# EAGLE schematic tablet (EAGLE 8.4.3)

## Sheet 1 of 2
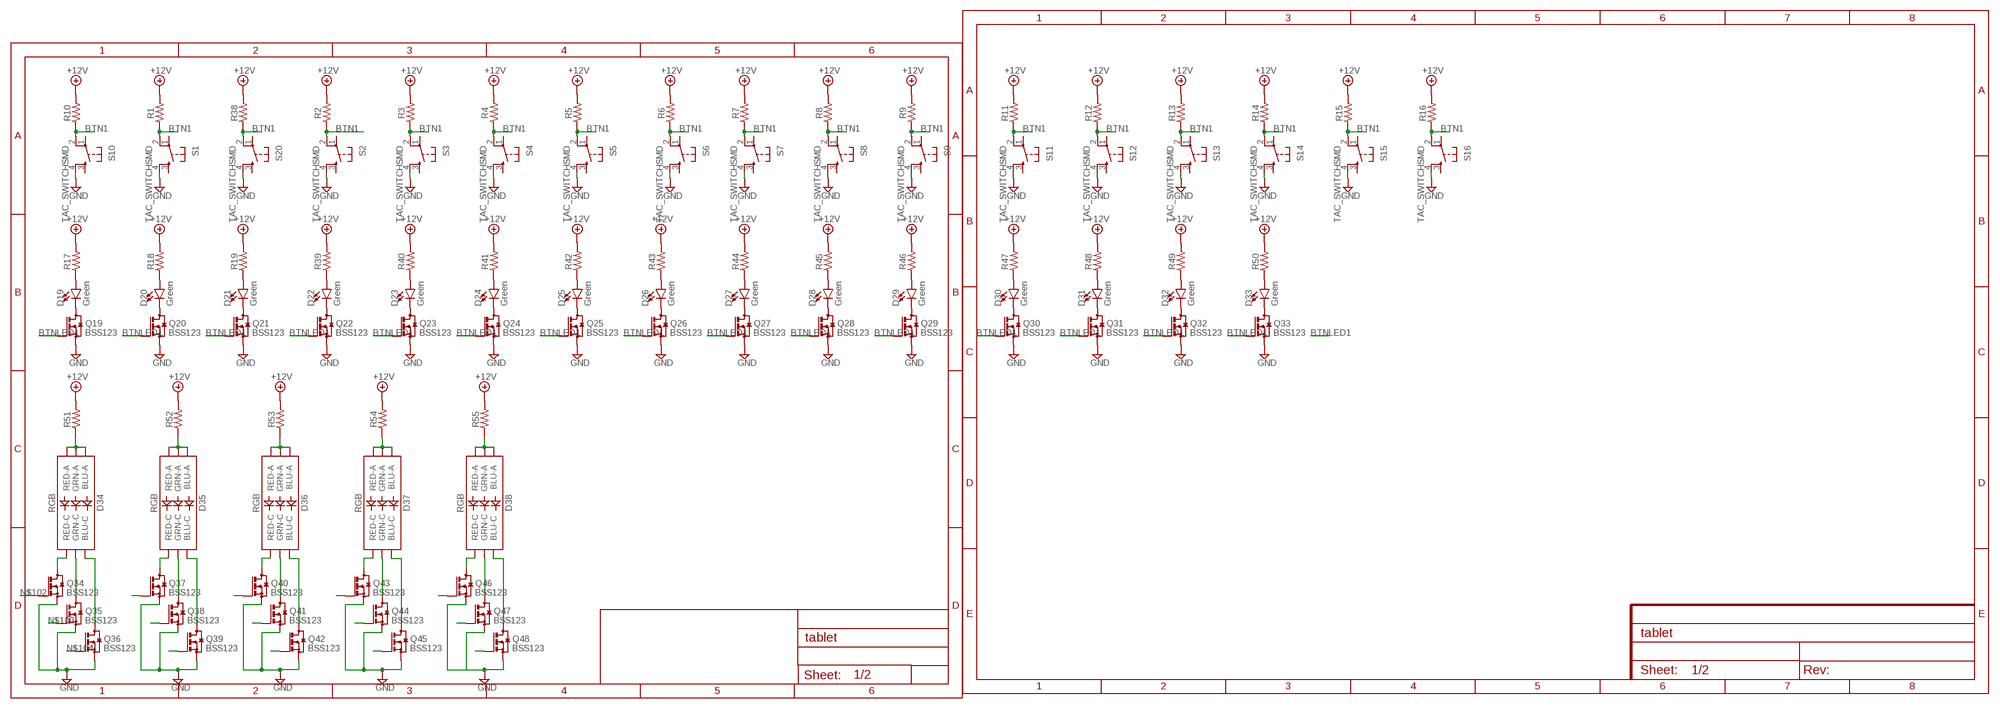
[diagram p0: schematic, sheet 1]

### Parts
D19  Green  LED-GREEN1206-BOTTOM  [LED-1206-BOTTOM]
D20  Green  LED-GREEN1206-BOTTOM  [LED-1206-BOTTOM]
D21  Green  LED-GREEN1206-BOTTOM  [LED-1206-BOTTOM]
D22  Green  LED-GREEN1206-BOTTOM  [LED-1206-BOTTOM]
D23  Green  LED-GREEN1206-BOTTOM  [LED-1206-BOTTOM]
D24  Green  LED-GREEN1206-BOTTOM  [LED-1206-BOTTOM]
D25  Green  LED-GREEN1206-BOTTOM  [LED-1206-BOTTOM]
D26  Green  LED-GREEN1206-BOTTOM  [LED-1206-BOTTOM]
D27  Green  LED-GREEN1206-BOTTOM  [LED-1206-BOTTOM]
D28  Green  LED-GREEN1206-BOTTOM  [LED-1206-BOTTOM]
D29  Green  LED-GREEN1206-BOTTOM  [LED-1206-BOTTOM]
D30  Green  LED-GREEN1206-BOTTOM  [LED-1206-BOTTOM]
D31  Green  LED-GREEN1206-BOTTOM  [LED-1206-BOTTOM]
D32  Green  LED-GREEN1206-BOTTOM  [LED-1206-BOTTOM]
D33  Green  LED-GREEN1206-BOTTOM  [LED-1206-BOTTOM]
D34  RGB  LED-RGBPLCC-6  [PLCC-6-LED]
D35  RGB  LED-RGBPLCC-6  [PLCC-6-LED]
D36  RGB  LED-RGBPLCC-6  [PLCC-6-LED]
D37  RGB  LED-RGBPLCC-6  [PLCC-6-LED]
D38  RGB  LED-RGBPLCC-6  [PLCC-6-LED]
Q19  BSS123  [SOT23]
Q20  BSS123  [SOT23]
Q21  BSS123  [SOT23]
Q22  BSS123  [SOT23]
Q23  BSS123  [SOT23]
Q24  BSS123  [SOT23]
Q25  BSS123  [SOT23]
Q26  BSS123  [SOT23]
Q27  BSS123  [SOT23]
Q28  BSS123  [SOT23]
Q29  BSS123  [SOT23]
Q30  BSS123  [SOT23]
Q31  BSS123  [SOT23]
Q32  BSS123  [SOT23]
Q33  BSS123  [SOT23]
Q34  BSS123  [SOT23]
Q35  BSS123  [SOT23]
Q36  BSS123  [SOT23]
Q37  BSS123  [SOT23]
Q38  BSS123  [SOT23]
Q39  BSS123  [SOT23]
Q40  BSS123  [SOT23]
Q41  BSS123  [SOT23]
Q42  BSS123  [SOT23]
Q43  BSS123  [SOT23]
Q44  BSS123  [SOT23]
Q45  BSS123  [SOT23]
Q46  BSS123  [SOT23]
Q47  BSS123  [SOT23]
Q48  BSS123  [SOT23]
R1  RESISTOR1206  [1206]
R2  RESISTOR1206  [1206]
R3  RESISTOR1206  [1206]
R4  RESISTOR1206  [1206]
R5  RESISTOR1206  [1206]
R6  RESISTOR1206  [1206]
R7  RESISTOR1206  [1206]
R8  RESISTOR1206  [1206]
R9  RESISTOR1206  [1206]
R10  RESISTOR1206  [1206]
R11  RESISTOR1206  [1206]
R12  RESISTOR1206  [1206]
R13  RESISTOR1206  [1206]
R14  RESISTOR1206  [1206]
R15  RESISTOR1206  [1206]
R16  RESISTOR1206  [1206]
R17  RESISTOR1206  [1206]
R18  RESISTOR1206  [1206]
R19  RESISTOR1206  [1206]
R38  RESISTOR1206  [1206]
R39  RESISTOR1206  [1206]
R40  RESISTOR1206  [1206]
R41  RESISTOR1206  [1206]
R42  RESISTOR1206  [1206]
R43  RESISTOR1206  [1206]
R44  RESISTOR1206  [1206]
R45  RESISTOR1206  [1206]
R46  RESISTOR1206  [1206]
R47  RESISTOR1206  [1206]
R48  RESISTOR1206  [1206]
R49  RESISTOR1206  [1206]
R50  RESISTOR1206  [1206]
R51  RESISTOR1206  [1206]
R52  RESISTOR1206  [1206]
R53  RESISTOR1206  [1206]
R54  RESISTOR1206  [1206]
R55  RESISTOR1206  [1206]
S1  TAC_SWITCHSMD  [TACTILE-SWITCH-SMD]
S2  TAC_SWITCHSMD  [TACTILE-SWITCH-SMD]
S3  TAC_SWITCHSMD  [TACTILE-SWITCH-SMD]
S4  TAC_SWITCHSMD  [TACTILE-SWITCH-SMD]
S5  TAC_SWITCHSMD  [TACTILE-SWITCH-SMD]
S6  TAC_SWITCHSMD  [TACTILE-SWITCH-SMD]
S7  TAC_SWITCHSMD  [TACTILE-SWITCH-SMD]
S8  TAC_SWITCHSMD  [TACTILE-SWITCH-SMD]
S9  TAC_SWITCHSMD  [TACTILE-SWITCH-SMD]
S10  TAC_SWITCHSMD  [TACTILE-SWITCH-SMD]
S11  TAC_SWITCHSMD  [TACTILE-SWITCH-SMD]
S12  TAC_SWITCHSMD  [TACTILE-SWITCH-SMD]
S13  TAC_SWITCHSMD  [TACTILE-SWITCH-SMD]
S14  TAC_SWITCHSMD  [TACTILE-SWITCH-SMD]
S15  TAC_SWITCHSMD  [TACTILE-SWITCH-SMD]
S16  TAC_SWITCHSMD  [TACTILE-SWITCH-SMD]
S20  TAC_SWITCHSMD  [TACTILE-SWITCH-SMD]

### Nets
+12V: R1.2 R2.2 R3.2 R4.2 R5.2 R6.2 R7.2 R8.2 R9.2 R10.2 R11.2 R12.2 R13.2 R14.2 R15.2 R16.2 R17.2 R18.2 R19.2 R38.2 R39.2 R40.2 R41.2 R42.2 R43.2 R44.2 R45.2 R46.2 R47.2 R48.2 R49.2 R50.2 R51.2 R52.2 R53.2 R54.2 R55.2 ; also sheet 2
BTN1: R1.1 R2.1 R3.1 R4.1 R5.1 R6.1 R7.1 R8.1 R9.1 R10.1 R11.1 R12.1 R13.1 R14.1 R15.1 R16.1 R38.1 S1.2 S2.2 S3.2 S4.2 S5.2 S6.2 S7.2 S8.2 S9.2 S10.2 S11.2 S12.2 S13.2 S14.2 S15.2 S16.2 S20.2
BTNLED1: Q19.1(G) Q20.1(G) Q21.1(G) Q22.1(G) Q23.1(G) Q24.1(G) Q25.1(G) Q26.1(G) Q27.1(G) Q28.1(G) Q29.1(G) Q30.1(G) Q31.1(G) Q32.1(G) Q33.1(G) ; also sheet 2
GND: Q19.2(S) Q20.2(S) Q21.2(S) Q22.2(S) Q23.2(S) Q24.2(S) Q25.2(S) Q26.2(S) Q27.2(S) Q28.2(S) Q29.2(S) Q30.2(S) Q31.2(S) Q32.2(S) Q33.2(S) Q34.2(S) Q35.2(S) Q36.2(S) Q37.2(S) Q38.2(S) Q39.2(S) Q40.2(S) Q41.2(S) Q42.2(S) Q43.2(S) Q44.2(S) Q45.2(S) Q46.2(S) Q47.2(S) Q48.2(S) S1.4 S2.4 S3.4 S4.4 S5.4 S6.4 S7.4 S8.4 S9.4 S10.4 S11.4 S12.4 S13.4 S14.4 S15.4 S16.4 S20.4 ; also sheet 2
N$37: D19.C Q19.3(D)
N$38: D19.A R17.1
N$39: D20.C Q20.3(D)
N$40: D20.A R18.1
N$41: D21.C Q21.3(D)
N$42: D21.A R19.1
N$43: D22.C Q22.3(D)
N$44: D22.A R39.1
N$45: D23.C Q23.3(D)
N$46: D23.A R40.1
N$47: D24.C Q24.3(D)
N$48: D24.A R41.1
N$49: D25.C Q25.3(D)
N$50: D25.A R42.1
N$51: D26.C Q26.3(D)
N$52: D26.A R43.1
N$53: D27.C Q27.3(D)
N$54: D27.A R44.1
N$55: D28.C Q28.3(D)
N$56: D28.A R45.1
N$57: D29.C Q29.3(D)
N$58: D29.A R46.1
N$59: D30.C Q30.3(D)
N$60: D30.A R47.1
N$61: D31.C Q31.3(D)
N$62: D31.A R48.1
N$63: D32.C Q32.3(D)
N$64: D32.A R49.1
N$65: D33.C Q33.3(D)
N$66: D33.A R50.1
N$67: D34.AB(BLU-A) D34.AR(RED-A) R51.1
N$68: D35.AB(BLU-A) D35.AR(RED-A) R52.1
N$69: D36.AB(BLU-A) D36.AR(RED-A) R53.1
N$70: D37.AB(BLU-A) D37.AR(RED-A) R54.1
N$71: D38.AB(BLU-A) D38.AR(RED-A) R55.1
N$72: D34.CR(RED-C) Q34.3(D)
N$73: D34.CG(GRN-C) Q35.3(D)
N$74: D34.CB(BLU-C) Q36.3(D)
N$78: D35.CR(RED-C) Q37.3(D)
N$79: D35.CG(GRN-C) Q38.3(D)
N$80: D35.CB(BLU-C) Q39.3(D)
N$84: D36.CR(RED-C) Q40.3(D)
N$85: D36.CG(GRN-C) Q41.3(D)
N$86: D36.CB(BLU-C) Q42.3(D)
N$90: D37.CR(RED-C) Q43.3(D)
N$91: D37.CG(GRN-C) Q44.3(D)
N$92: D37.CB(BLU-C) Q45.3(D)
N$96: D38.CR(RED-C) Q46.3(D)
N$97: D38.CG(GRN-C) Q47.3(D)
N$98: D38.CB(BLU-C) Q48.3(D)
N$102: Q34.1(G)
N$103: Q35.1(G)
N$104: Q36.1(G)
N$105: Q39.1(G)
N$106: Q38.1(G)
N$107: Q37.1(G)
N$108: Q40.1(G)
N$109: Q41.1(G)
N$110: Q42.1(G)
N$111: Q43.1(G)
N$112: Q44.1(G)
N$113: Q45.1(G)
N$114: Q46.1(G)
N$115: Q47.1(G)
N$116: Q48.1(G)
Unconnected: D34.AG(GRN-A) D35.AG(GRN-A) D36.AG(GRN-A) D37.AG(GRN-A) D38.AG(GRN-A) S1.1 S1.3 S2.1 S2.3 S3.1 S3.3 S4.1 S4.3 S5.1 S5.3 S6.1 S6.3 S7.1 S7.3 S8.1 S8.3 S9.1 S9.3 S10.1 S10.3 S11.1 S11.3 S12.1 S12.3 S13.1 S13.3 S14.1 S14.3 S15.1 S15.3 S16.1 S16.3 S20.1 S20.3

## Sheet 2 of 2
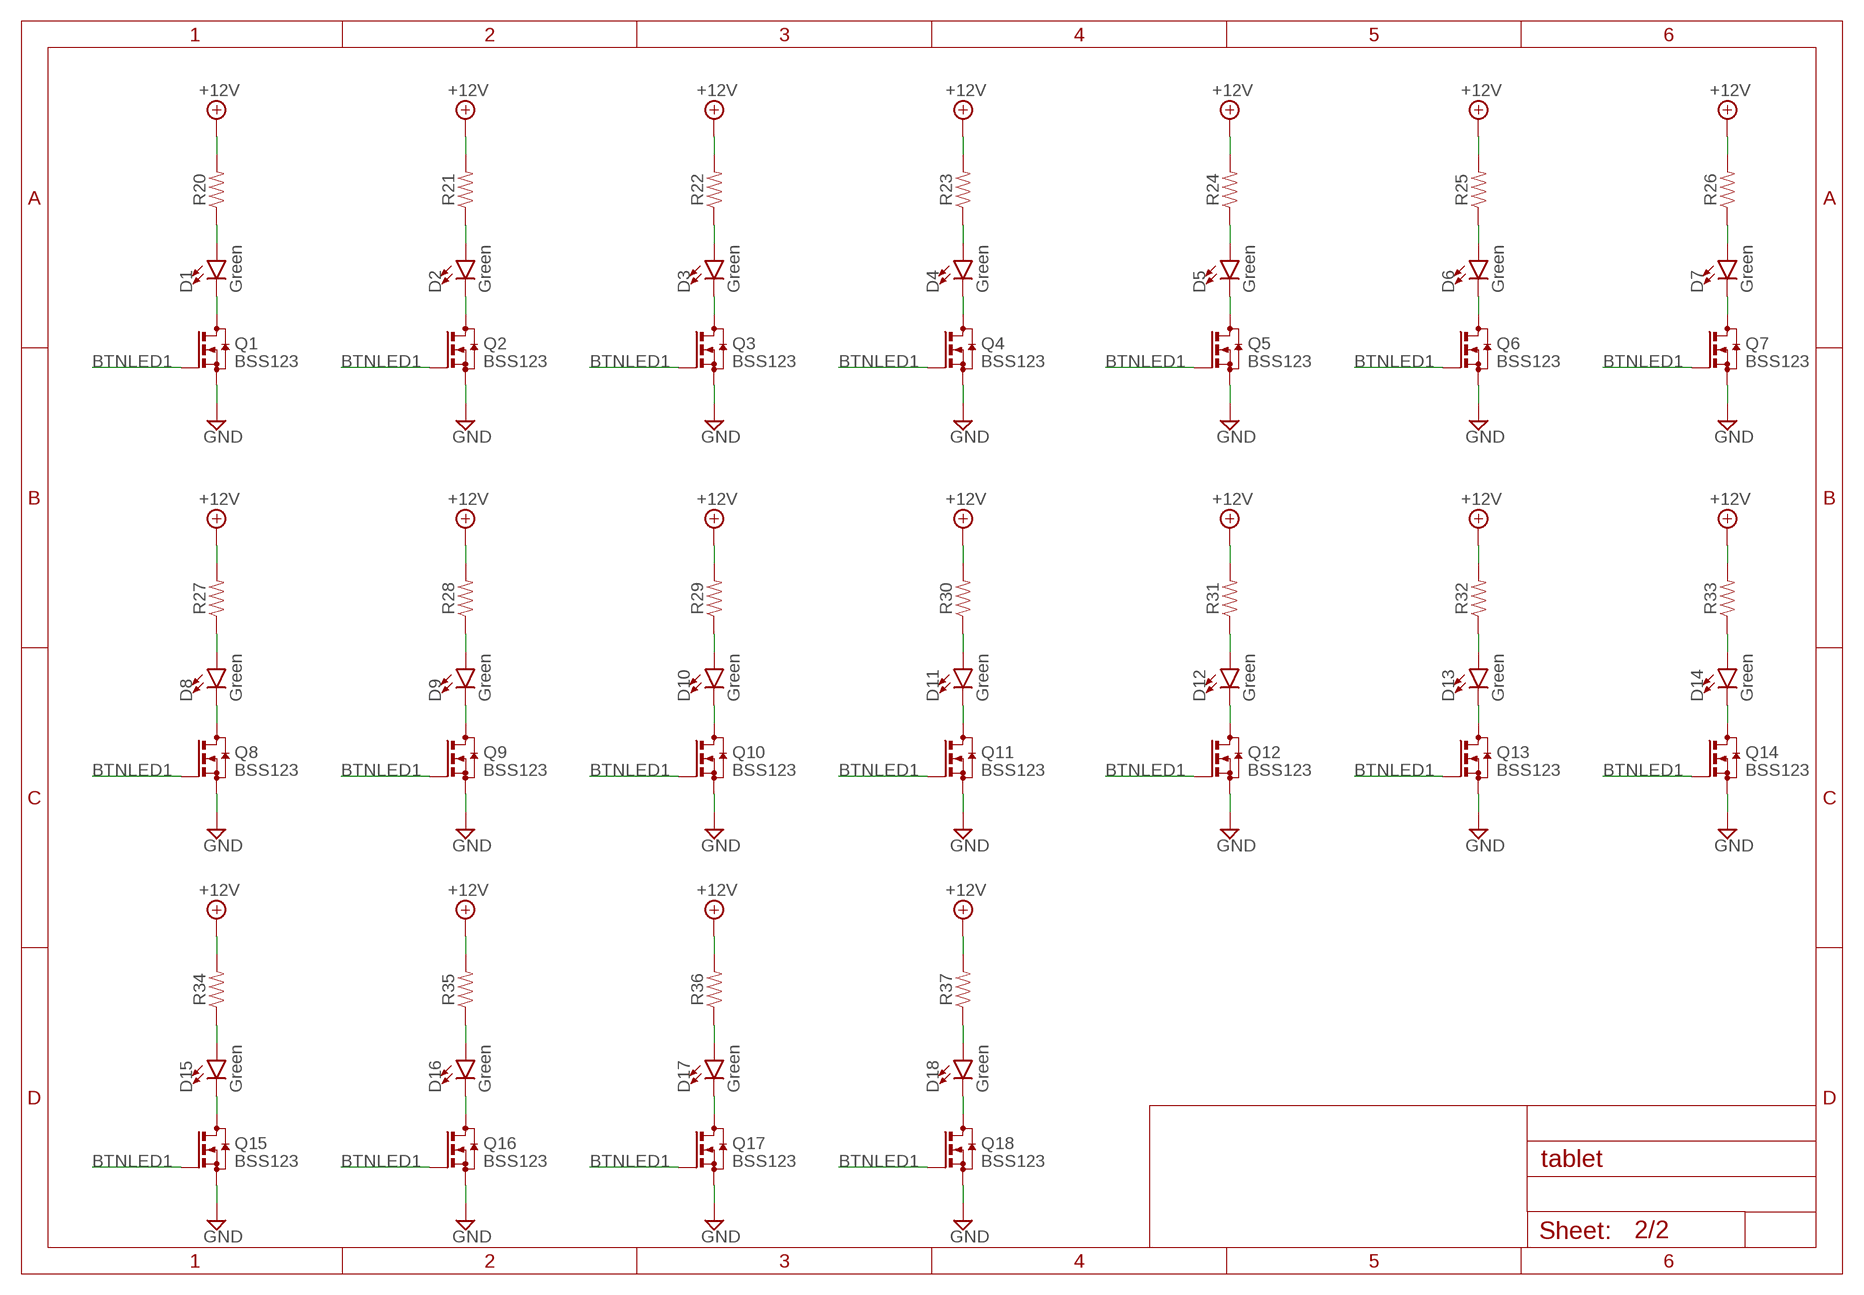
[diagram p1: schematic, sheet 2]

### Parts
D1  Green  LED-GREEN1206-BOTTOM  [LED-1206-BOTTOM]
D2  Green  LED-GREEN1206-BOTTOM  [LED-1206-BOTTOM]
D3  Green  LED-GREEN1206-BOTTOM  [LED-1206-BOTTOM]
D4  Green  LED-GREEN1206-BOTTOM  [LED-1206-BOTTOM]
D5  Green  LED-GREEN1206-BOTTOM  [LED-1206-BOTTOM]
D6  Green  LED-GREEN1206-BOTTOM  [LED-1206-BOTTOM]
D7  Green  LED-GREEN1206-BOTTOM  [LED-1206-BOTTOM]
D8  Green  LED-GREEN1206-BOTTOM  [LED-1206-BOTTOM]
D9  Green  LED-GREEN1206-BOTTOM  [LED-1206-BOTTOM]
D10  Green  LED-GREEN1206-BOTTOM  [LED-1206-BOTTOM]
D11  Green  LED-GREEN1206-BOTTOM  [LED-1206-BOTTOM]
D12  Green  LED-GREEN1206-BOTTOM  [LED-1206-BOTTOM]
D13  Green  LED-GREEN1206-BOTTOM  [LED-1206-BOTTOM]
D14  Green  LED-GREEN1206-BOTTOM  [LED-1206-BOTTOM]
D15  Green  LED-GREEN1206-BOTTOM  [LED-1206-BOTTOM]
D16  Green  LED-GREEN1206-BOTTOM  [LED-1206-BOTTOM]
D17  Green  LED-GREEN1206-BOTTOM  [LED-1206-BOTTOM]
D18  Green  LED-GREEN1206-BOTTOM  [LED-1206-BOTTOM]
Q1  BSS123  [SOT23]
Q2  BSS123  [SOT23]
Q3  BSS123  [SOT23]
Q4  BSS123  [SOT23]
Q5  BSS123  [SOT23]
Q6  BSS123  [SOT23]
Q7  BSS123  [SOT23]
Q8  BSS123  [SOT23]
Q9  BSS123  [SOT23]
Q10  BSS123  [SOT23]
Q11  BSS123  [SOT23]
Q12  BSS123  [SOT23]
Q13  BSS123  [SOT23]
Q14  BSS123  [SOT23]
Q15  BSS123  [SOT23]
Q16  BSS123  [SOT23]
Q17  BSS123  [SOT23]
Q18  BSS123  [SOT23]
R20  RESISTOR1206  [1206]
R21  RESISTOR1206  [1206]
R22  RESISTOR1206  [1206]
R23  RESISTOR1206  [1206]
R24  RESISTOR1206  [1206]
R25  RESISTOR1206  [1206]
R26  RESISTOR1206  [1206]
R27  RESISTOR1206  [1206]
R28  RESISTOR1206  [1206]
R29  RESISTOR1206  [1206]
R30  RESISTOR1206  [1206]
R31  RESISTOR1206  [1206]
R32  RESISTOR1206  [1206]
R33  RESISTOR1206  [1206]
R34  RESISTOR1206  [1206]
R35  RESISTOR1206  [1206]
R36  RESISTOR1206  [1206]
R37  RESISTOR1206  [1206]

### Nets
+12V: R20.2 R21.2 R22.2 R23.2 R24.2 R25.2 R26.2 R27.2 R28.2 R29.2 R30.2 R31.2 R32.2 R33.2 R34.2 R35.2 R36.2 R37.2 ; also sheet 1
BTNLED1: Q1.1(G) Q2.1(G) Q3.1(G) Q4.1(G) Q5.1(G) Q6.1(G) Q7.1(G) Q8.1(G) Q9.1(G) Q10.1(G) Q11.1(G) Q12.1(G) Q13.1(G) Q14.1(G) Q15.1(G) Q16.1(G) Q17.1(G) Q18.1(G) ; also sheet 1
GND: Q1.2(S) Q2.2(S) Q3.2(S) Q4.2(S) Q5.2(S) Q6.2(S) Q7.2(S) Q8.2(S) Q9.2(S) Q10.2(S) Q11.2(S) Q12.2(S) Q13.2(S) Q14.2(S) Q15.2(S) Q16.2(S) Q17.2(S) Q18.2(S) ; also sheet 1
N$1: D1.A R20.1
N$2: D1.C Q1.3(D)
N$3: D2.A R21.1
N$4: D2.C Q2.3(D)
N$5: D3.A R22.1
N$6: D3.C Q3.3(D)
N$7: D4.A R23.1
N$8: D4.C Q4.3(D)
N$9: D5.A R24.1
N$10: D5.C Q5.3(D)
N$11: D6.A R25.1
N$12: D6.C Q6.3(D)
N$13: D7.A R26.1
N$14: D7.C Q7.3(D)
N$15: D8.A R27.1
N$16: D8.C Q8.3(D)
N$17: D9.A R28.1
N$18: D9.C Q9.3(D)
N$19: D10.A R29.1
N$20: D10.C Q10.3(D)
N$21: D11.A R30.1
N$22: D11.C Q11.3(D)
N$23: D12.A R31.1
N$24: D12.C Q12.3(D)
N$25: D13.A R32.1
N$26: D13.C Q13.3(D)
N$27: D14.A R33.1
N$28: D14.C Q14.3(D)
N$29: D15.A R34.1
N$30: D15.C Q15.3(D)
N$31: D16.A R35.1
N$32: D16.C Q16.3(D)
N$33: D17.A R36.1
N$34: D17.C Q17.3(D)
N$35: D18.A R37.1
N$36: D18.C Q18.3(D)

## Library data of the parts
D1-D33 = SparkFun-LED:LED-GREEN: Green SMD LED Used in manufacturing of various products at SparkFun Packages: 0603 - SMD 0603 package [Product Link] <http://www.futureelectronics.com/en/technologies/semiconductors/optoelectronics/leds/Pages/9894312-LTST-C190GKT.aspx?CrossPart=HSMG-C190&IM=0> LilyPad 1206 - SMD1206 LilyPad package [Product Link] <http://www.futureelectronics.com/en/Technologies/Product.aspx?ProductID=IN150NGHARVATEKCORPORATION2049943&IM=0> 1206 - SMD1206 package [Product Link] <http://www.futureelectronics.com/en/technologies/semiconductors/optoelectronics/leds/Pages/8315665-LTST-C150KGKT.aspx?IM=0> 1206 Bottom Mount -SMD 1206 Bottom Mount [Product Link] <http://www.digikey.com/product-detail/en/lite-on-inc/LTST-C230KGKT/160-1456-1-ND/386854> SparkFun Products: Pro Mini 328 -5V <https://www.sparkfun.com/products/821> RedBoard <https://www.sparkfun.com/products/12757> MP3 Trigger <https://www.sparkfun.com/products/13720> Makey Makey <https://www.sparkfun.com/products/11076>; PROD_ID: DIO-11076
D34-D38 = SparkFun-LED:LED-RGB: LED-RGB 6 pin RGB LED (no common connector) Packages: PLCC-6 LED-TRICOLOR-5050 - No built-in IC SparkFun Products: Digital Sandbox <https://www.sparkfun.com/products/12651> LED- SMD RGB <https://www.sparkfun.com/products/10866>; PROD_ID: DIO-12113
Q1-Q48 = transistor-small-signal:BSS123: N-CHANNEL MOS FET
R1-R55 = SparkFun-Resistors:RESISTOR: Generic Resistor Package
S1-S16 S20 = SparkFun-Retired:TAC_SWITCH: Momentary Switch Button commonly used for reset or general input. Spark Fun Electronics SKU : COM-00097 SMT- SWCH-08247; PROD_ID: SWCH-08247